# Altium project EzPowerV4 - REV09.PrjPcb (part 5 of 7)

## Sheet EVSE Control and GFCI.SchDoc: EVSE Control and GFCI
size A3; ApprovedBy: JTS; CheckedBy: JTS; DrawnBy: EBC; DocumentNumber: -; Revision: 09; SheetNumber: 5; SheetTotal: 7; SenaiProjectName: EzPower v4
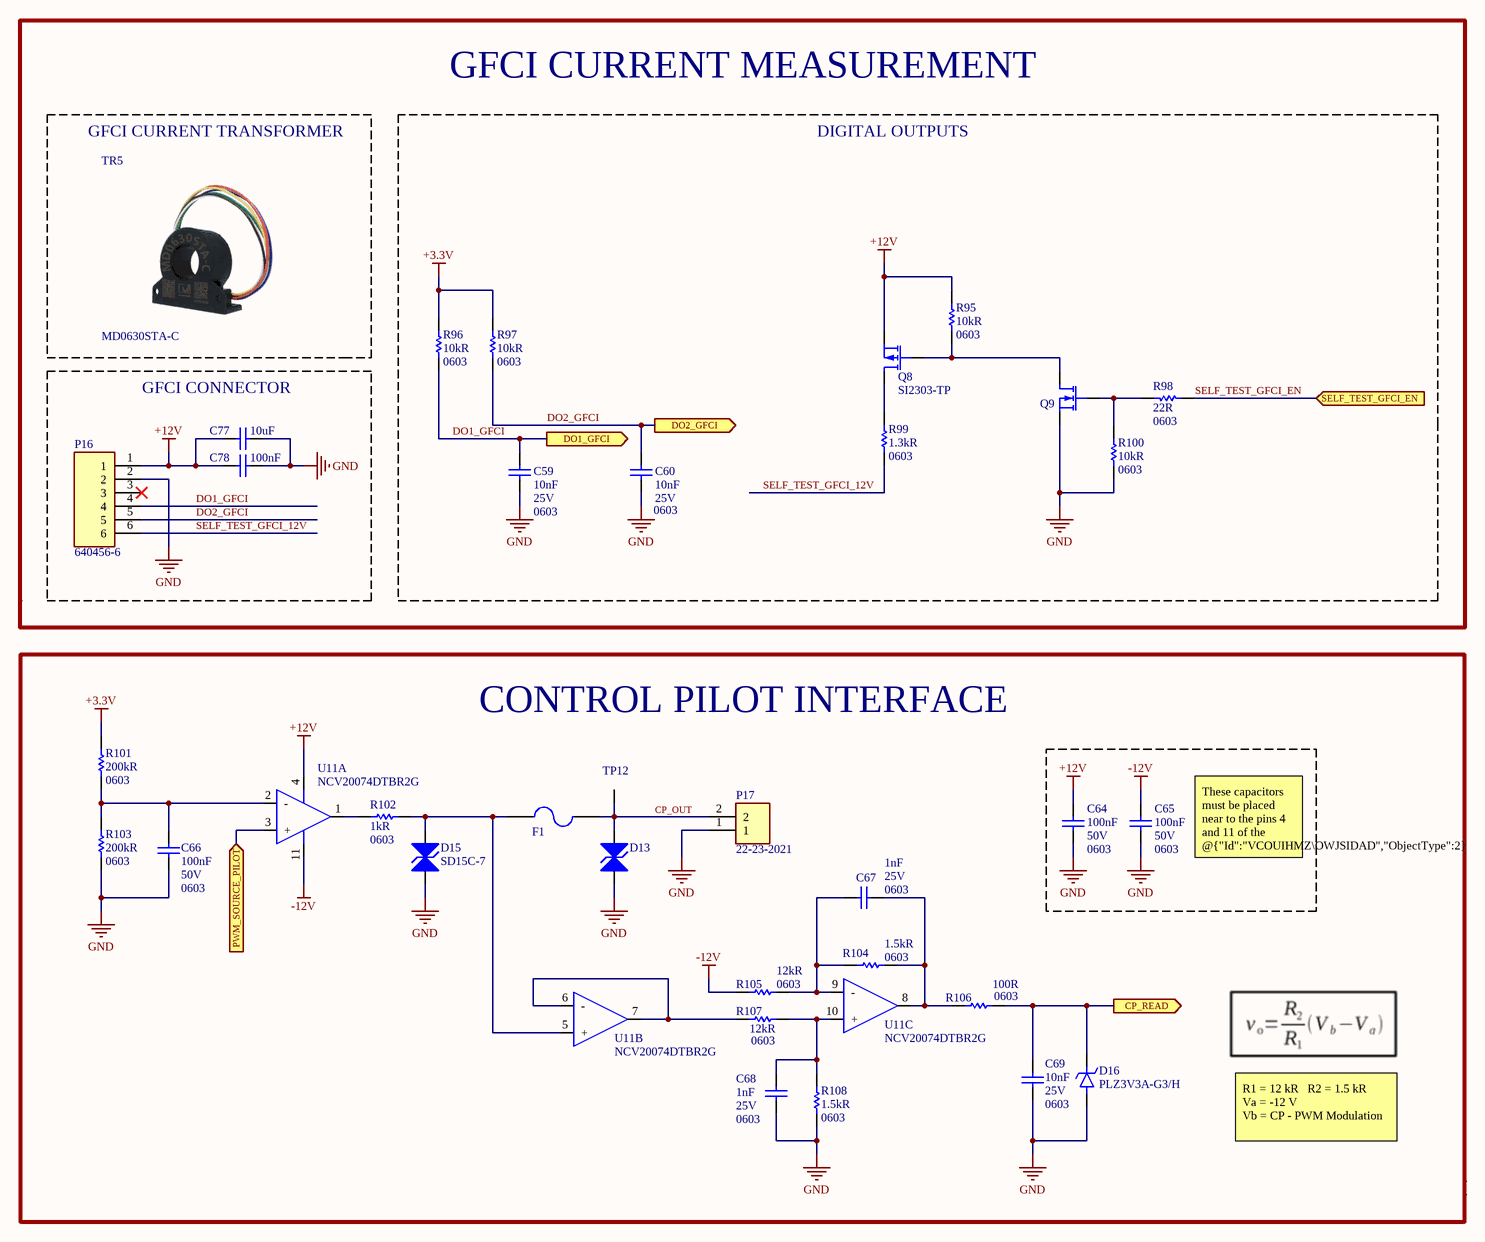
[diagram p7: EVSE Control and GFCI.SchDoc]

### Parts
C59  Voltage Rating: 25V  Capacitance: 10nF  Case Code (Imperial): 0603  [C0603]  (hidden comment: C_0603_0.01uF_25V_10%)
C60  Voltage Rating: 25V  Capacitance: 10nF  Case Code (Imperial): 0603  [C0603]  (hidden comment: C_0603_0.01uF_25V_10%)
C64  value 100nF  Case/Package: 0603  Voltage Rating: 50V  [C0603]  (hidden comment: CC0603MRX7R9BB104)
C65  value 100nF  Case/Package: 0603  Voltage Rating: 50V  [C0603]  (hidden comment: CC0603MRX7R9BB104)
C66  value 100nF  Case/Package: 0603  Voltage Rating: 50V  [C0603]  (hidden comment: CC0603MRX7R9BB104)
C67  value 1nF  Voltage Rating: 25V  Case Code (Imperial): 0603  [C0603]  (hidden comment: C0603C102J3GACTU)
C68  value 1nF  Voltage Rating: 25V  Case Code (Imperial): 0603  [C0603]  (hidden comment: C0603C102J3GACTU)
C69  Voltage Rating: 25V  Capacitance: 10nF  Case Code (Imperial): 0603  [C0603]  (hidden comment: C_0603_0.01uF_25V_10%)
C77  Capacitance: 10uF  [C0603]  (hidden comment: C_0603_10uF_35V_20%)
C78  value 100nF  [C0603]  (hidden comment: CC0603MRX7R9BB104)
D13  SM30T15CAY  [DO-214AB-2]  (value not drawn)
D15  SD15C-7  [SOD323]
D16  PLZ3V3A-G3/H  [DO-219AC-2]
F1  0ZCM0002FF2G  [F0603]  (value not drawn)
P16  640456-6  [HEADER_2.54MM_6POS_PTH]
P17  22-23-2021  [HEADER_KK_2.54MM_2POS]
Q8  SI2303-TP  [SOT23]
Q9  RSF015N06FRATL  [TUMT-3]  (value not drawn)
R95  value 10kR  Case/Package: 0603  [R0603]  (hidden comment: CRCW060310K0JNEBC)
R96  value 10kR  Case/Package: 0603  [R0603]  (hidden comment: CRCW060310K0JNEBC)
R97  value 10kR  Case/Package: 0603  [R0603]  (hidden comment: CRCW060310K0JNEBC)
R98  Resistance: 22R  Case Code (Imperial): 0603  [R0603]  (hidden comment: CRCW060322R0FKEAC)
R99  value 1.3kR  Case Code (Imperial): 0603  [R0603]  (hidden comment: ERJ-PA3F1301V)
R100  value 10kR  Case/Package: 0603  [R0603]  (hidden comment: CRCW060310K0JNEBC)
R101  value 200kR  Case/Package: 0603  [R0603]  (hidden comment: RT0603FRD07200KL)
R102  value 1kR  Case/Package: 0603  [R0603]  (hidden comment: CRT0603-FY-1001ELF)
R103  value 200kR  Case/Package: 0603  [R0603]  (hidden comment: RT0603FRD07200KL)
R104  value 1.5kR  Case Code (Imperial): 0603  [R0603]  (hidden comment: RN73H1JTTD1501F25)
R105  value 12kR  Case Code (Imperial): 0603  [R0603]  (hidden comment: RT0603DRD0712KL)
R106  value 100R  Case/Package: 0603  [R0603]  (hidden comment: CRT0603-FY-1000ELF)
R107  value 12kR  Case Code (Imperial): 0603  [R0603]  (hidden comment: RT0603DRD0712KL)
R108  value 1.5kR  Case Code (Imperial): 0603  [R0603]  (hidden comment: RN73H1JTTD1501F25)
TP12  S2761-46R  [TP_S276146R]  (value not drawn)
TR5  MD0630STA-C  [TC_MD0630STA-C]
U11  NCV20074DTBR2G  [TSSOP-14]  (parts A,B,C of 4)

### Blocks framed on the sheet
GFCI CURRENT TRANSFORMER: TR5
DIGITAL OUTPUTS: C59 C60 Q8 Q9 R95-R100
GFCI CONNECTOR: C77 C78 P16

### Ports
CP_READ (out), DO1_GFCI (out), DO2_GFCI (out), PWM_SOURCE_PILOT (in), SELF_TEST_GFCI_EN (in)

### Nets
+3.3V: R96.2 R97.2 R101.1
+12V: C64.1 C77.2 C78.2 P16.1 Q8.2(S) R95.2 U11.4(V+)
-12V: C65.1 R105.1 U11.11(V-)
GND: C59.1 C60.1 C64.2 C65.2 C66.2 C68.1 C69.2 C77.1 C78.1 D13.1 D15.1 D16.2(A) P16.2 P17.1 Q9.2(S) R100.1 R103.2 R108.2  [project net EARTH]
CP_OUT: D13.2 F1.2 P17.2 TP12.1
DO1_GFCI: C59.2 P16.4 R96.1 ; port DO1_GFCI
DO2_GFCI: C60.2 P16.5 R97.1 ; port DO2_GFCI
SELF_TEST_GFCI_12V: P16.6 R99.1
SELF_TEST_GFCI_EN: R98.2 ; port SELF_TEST_GFCI_EN
NetC66_1: C66.1 R101.2 R103.1 U11.2(-)
NetC67_1: C67.1 R104.2 R106.1 U11.8(OUT_C)
NetC67_2: C67.2 R104.1 R105.2 U11.9(-)
NetC68_2: C68.2 R107.2 R108.1 U11.10(+)
NetC69_1: C69.1 D16.1(K) R106.2 ; port CP_READ
NetD15_2: D15.2 F1.1 R102.1 U11.5(+)
NetQ8_1: Q8.1(G) Q9.3(D) R95.1
NetQ8_3: Q8.3(D) R99.2
NetQ9_1: Q9.1(G) R98.1 R100.2
NetR102_2: R102.2 U11.1(OUT_A)
NetR107_1: R107.1 U11.6(-) U11.7(OUT_B)
NetU1_30: U11.3(+) ; port PWM_SOURCE_PILOT

Not connected (* = marked no-connect by the designer): P16 3*

### Notes on the sheet
- GFCI CURRENT MEASUREMENT
- CONTROL PILOT INTERFACE
- These capacitors must be placed near to the pins 4 and 11 of the @{"Id":"VCOUIHMZ\OWJSIDAD","ObjectType":2}
- R1 = 12 kR   R2 = 1.5 kR
  Va = -12 V
  Vb = CP - PWM Modulation
- Title:
- Project:
- Variant:
- Size:
- Drawn by:
- A3
- Revision:
- Date:
- Sheet
- Time:
- of
- Checked by:
- Approved by:

### Library data of the parts
C59 C60 C69 = C_0603_0.01uF_25V_10%: Surface Mount Ceramic Multilayer Capacitor 0.01uF 10% X7R 25V 0603 Paper T/R; Manufacturer: Yageo; Manufacturer Part Number: CC0603KRX7R8BB103; Insulation Resistance: 100GR; Supplier 1: RSComponents; RoHS: Yes; Category: Ceramic Capacitors; Stock 1: 36000; Pricing 1: 4000=0,00900, 8000=0,00800, 16000=0,00700 (GBP); Mount: Surface Mount; Case/Package: 0603; Number of Pins: 2; Case Code (Metric): 1608; Dielectric Material: Ceramic; Min Operating Temperature: -55°C; Max Operating Temperature: 125°C; Tolerance: 10%; Dielectric: X7R; Voltage Rating (DC): 25V; Packaging: Tape and Reel; Package Quantity: 1; Termination: SMD/SMT; Resistor Type: Ceramic; Voltage: 25V; Series: CC; Length: 1.6mm; Width: 0.8mm; Height: 0.8mm; Thickness: 0.035inch; Depth: 0.8mm; Radiation Hardening: No; RoHS Compliant: Yes; REACH SVHC: Unknown; Lead Free: Lead Free; Halogen Free: Halogen Free; ComponentLink1URL: https://datasheet.ciiva.com/26862/getdatasheetpartid-134630-26862833.pdf?src-supplier=Verical; ComponentLink1Description: https://datasheet.ciiva.com/26862/getdatasheetpartid-134630-26862833.pdf?src-supplier=Verical; ComponentLink2URL: https://datasheet.ciiva.com/8033/70765-8033820.pdf?src-supplier=Element14; ComponentLink2Description: https://datasheet.ciiva.com/8033/70765-8033820.pdf?src-supplier=Element14; ComponentLink3URL: https://datasheet.ciiva.com/7978/1489800-7978152.pdf?src-supplier=Element14; ComponentLink3Description: https://datasheet.ciiva.com/7978/1489800-7978152.pdf?src-supplier=Element14; ComponentLink4URL: https://datasheet.ciiva.com/28450/1489800-28450573.pdf?src-supplier=Element14; ComponentLink4Description: https://datasheet.ciiva.com/28450/1489800-28450573.pdf?src-supplier=Element14; ComponentLink5URL: https://datasheet.ciiva.com/46430/1734573-46430157.pdf?src-supplier=Element14; ComponentLink5Description: https://datasheet.ciiva.com/46430/1734573-46430157.pdf?src-supplier=Element14; ComponentLink6URL: https://datasheet.ciiva.com/8033/1734573-8033822.pdf?src-supplier=Element14; ComponentLink6Description: https://datasheet.ciiva.com/8033/1734573-8033822.pdf?src-supplier=Element14; ComponentLink7URL: https://datasheet.ciiva.com/144/mlccorderingcode-144150.pdf?src-supplier=Digi-Key; ComponentLink7Description: https://datasheet.ciiva.com/144/mlccorderingcode-144150.pdf?src-supplier=Digi-Key; ComponentLink8URL: https://datasheet.ciiva.com/144/mlccorderingcode-144149.pdf?src-supplier=Digi-Key; ComponentLink8Description: https://datasheet.ciiva.com/144/mlccorderingcode-144149.pdf?src-supplier=Digi-Key; ComponentLink9URL: https://datasheet.ciiva.com/144/mlccorderingcode-144151.pdf?src-supplier=Digi-Key; ComponentLink9Description: https://datasheet.ciiva.com/144/mlccorderingcode-144151.pdf?src-supplier=Digi-Key; ComponentLink10URL: https://datasheet.ciiva.com/11465/upy-gphc-x7r-6-3v-to-50v-8-11465198.pdf?src-supplier=Avnet; ComponentLink10Description: https://datasheet.ciiva.com/11465/upy-gphc-x7r-6-3v-to-50v-8-11465198.pdf?src-supplier=Avnet; Supplier Part Number 1: 6698814
C64-C66 C78 = C_0603_0.1uF_50V_20%: Cap Ceramic 50V 20% +Tol 20% -Tol X7R 15% TC 0.1uF SMD 0603; Manufacturer: Yageo; Supplier 1: Arrow Electronics; Manufacturer Part Number: CC0603MRX7R9BB104; RoHS: Yes; Category: Ceramic Capacitors; Stock 1: 19775; Pricing 1: 4000=0,00850, 8000=0,00780, 12000=0,00740, 28000=0,00700, 100000=0,00520 (USD); Mounting Technology: Surface Mount; Case Code (Imperial): 0603; Case Code (Metric): 1608; Min Operating Temperature: -55°C; Max Operating Temperature: 125°C; Packaging: Tape and Reel; Tolerance: 20%; Dielectric: X7R; Voltage Rating (DC): 50V; Series: CC; Length: 0.063inch; Width: 0.031inch; Thickness: 0.035inch; Lead Free: Lead Free; Halogen Free: Halogen Free; RoHS Compliant: Yes; ComponentLink1URL: http://www.yageo.com/documents/recent/UPY-GPHC_X7R_6.3V-to-50V_18.pdf?src-supplier=Digi-Key; ComponentLink1Description: http://www.yageo.com/documents/recent/UPY-GPHC_X7R_6.3V-to-50V_18.pdf?src-supplier=Digi-Key; ComponentLink2URL: https://www.yageo.com/upload/media/product/productsearch/datasheet/mlcc/UPY-GPHC_X7R_6.3V-to-50V_18.pdf?src-supplier=Digi-Key; ComponentLink2Description: https://www.yageo.com/upload/media/product/productsearch/datasheet/mlcc/UPY-GPHC_X7R_6.3V-to-50V_18.pdf?src-supplier=Digi-Key; ComponentLink3URL: http://www.yageo.com/exep/pages/download/literatures/ProductSelectionGuide%202014_Final_2.pdf?src-supplier=Digi-Key; ComponentLink3Description: http://www.yageo.com/exep/pages/download/literatures/ProductSelectionGuide%202014_Final_2.pdf?src-supplier=Digi-Key; Supplier Part Number 1: CC0603MRX7R9BB104
C67 C68 = C_0603_1000pF_25V_5%: 0603 C 1nF Ceramic Multilayer Capacitor; 25 VDC; +125degC; C0G Dielectric; +/-5%; Manufacturer: KEMET; Tolerance: 5%; Temperature Coefficient: 30ppm/°C; Supplier 1: Mouser; Manufacturer Part Number: C0603C102J3GACTU; RoHS: Yes; Category: Ceramic Capacitors; Stock 1: 81365; Pricing 1: 1=0,1, 10=0,048, 50=0,048, 100=0,022, 1000=0,013, 10000=0,008 (USD); Mounting Technology: Surface Mount; Case/Package: 0603; Pins: 2; Case Code (Metric): 1608; Dielectric Material: Ceramic; Min Operating Temperature: -55°C; Max Operating Temperature: 125°C; Packaging: Tape and Reel; Package Quantity: 1; Voltage Rating (DC): 25V; Dielectric: C0G; Termination: SMD/SMT; Voltage: 25V; Series: C; Construction: Flat; Length: 1.6mm; Width: 0.031inch; Height: 0.8mm; Lead Pitch: 0.7mm; Thickness: 0.034inch; Depth: 0.8mm; Radiation Hardening: No; Reach SVHC Compliant: No; Lead Free: Lead Free; RoHS Compliant: Yes; ComponentLink1URL: https://datasheet.ciiva.com/18192/getdatasheetpartid-127803-18192629.pdf?src-supplier=Verical; ComponentLink1Description: https://datasheet.ciiva.com/18192/getdatasheetpartid-127803-18192629.pdf?src-supplier=Verical; ComponentLink2URL: https://datasheet.ciiva.com/7823/f9080b-0402-series-c0g-7823966.pdf?src-supplier=Element14; ComponentLink2Description: https://datasheet.ciiva.com/7823/f9080b-0402-series-c0g-7823966.pdf?src-supplier=Element14; ComponentLink3URL: https://datasheet.ciiva.com/7823/f9080b-0402-series-c0g-7823967.pdf?src-supplier=Element14; ComponentLink3Description: https://datasheet.ciiva.com/7823/f9080b-0402-series-c0g-7823967.pdf?src-supplier=Element14; Supplier Part Number 1: 80-C0603C102J3G
C77 = C_0603_10uF_35V_20%: Cap Ceramic 10uF 35V X5R 20% Pad SMD 0603 85C T/R; Manufacturer: Murata; Manufacturer Part Number: GRM188R6YA106MA73D; Supplier 1: Arrow Electronics; RoHS: Yes; Category: Ceramic Capacitors; Stock 1: 32291; Pricing 1: 1=0,31230, 10=0,18330, 25=0,18150, 100=0,12390, 250=0,12260, 500=0,08640, 1000=0,08550, 3000=0,07600, 6000=0,06650, 15000=0,06580, 30000=0,05360 (USD); Mount: Surface Mount; Case Code (Metric): 1608; Case Code (Imperial): 0603; Min Operating Temperature: -55°C; Max Operating Temperature: 85°C; Packaging: Tape and Reel; Voltage Rating (DC): 35V; Dielectric: X5R; Length: 0.063inch; Width: 0.031inch; Thickness: 0.039inch; RoHS Compliant: Yes; ComponentLink1URL: http://search.murata.co.jp/Ceramy/image/img/A01X/G101/ENG/GRM188R6YA106MA73-01.pdf?src-supplier=Future+Electronics; ComponentLink1Description: http://search.murata.co.jp/Ceramy/image/img/A01X/G101/ENG/GRM188R6YA106MA73-01.pdf?src-supplier=Future+Electronics; ComponentLink2URL: http://search.murata.co.jp/Ceramy/image/img/A01X/G101/ENG/GRM188R6YA106MA73-01.pdf?src-supplier=Digi-Key; ComponentLink2Description: http://search.murata.co.jp/Ceramy/image/img/A01X/G101/ENG/GRM188R6YA106MA73-01.pdf?src-supplier=Digi-Key; ComponentLink3URL: https://www.murata.com/~/media/webrenewal/support/library/catalog/products/capacitor/mlcc/c02e.ashx?la=en-us&src-supplier=Digi-Key; ComponentLink3Description: https://www.murata.com/~/media/webrenewal/support/library/catalog/products/capacitor/mlcc/c02e.ashx?la=en-us&src-supplier=Digi-Key; ComponentLink4URL: http://search.murata.co.jp/Ceramy/image/img/A01X/G101/ENG/GRM188R6YA106MA73-01.pdf?src-supplier=Mouser; ComponentLink4Description: http://search.murata.co.jp/Ceramy/image/img/A01X/G101/ENG/GRM188R6YA106MA73-01.pdf?src-supplier=Mouser; ComponentLink5URL: http://search.murata.co.jp/Ceramy/image/img/A01X/G101/ENG/GRM188R6YA106MA73-01.pdf?src-supplier=TTI; ComponentLink5Description: http://search.murata.co.jp/Ceramy/image/img/A01X/G101/ENG/GRM188R6YA106MA73-01.pdf?src-supplier=TTI; Tolerance: 20%; Supplier Part Number 1: GRM188R6YA106MA73D
D13 = D_TVS_SM30T15CAY: Trans Voltage Suppressor Diode, 3000W, 13V V(RWM), Bidirectional, 1 Element, Silicon, DO-214AB; Manufacturer: STMicroelectronics; Package Body Material: Plastic; Max Breakdown Voltage: 15.8V; Min Breakdown Voltage: 14.3V; Non-rep Peak Rev Power Dis-Max: 3kW; Number of Elements: 1; Reference Standard: AEC-Q101; Supplier: Arrow Electronics; Supplier Part Number: SM30T15CAY; Manufacturer Part Number: SM30T15CAY; RoHS: Yes; Category: TVS Diodes; Stock: 1424; Pricing: 1=0,5137 (USD); Pins: 2; Diode Element Material: SILICON; Package Shape: Rectangular; Min Operating Temperature: -55°C; Max Operating Temperature: 175°C; Polarity: Bidirectional; Diode Type: TRANS VOLTAGE SUPPRESSOR; JESD-30 Code: R-PDSO-C2; Package Style: SMALL OUTLINEMeter; Rep Pk Reverse Voltage-Max: 13V; Surface Mount: Yes; Technology: AVALANCHE; Terminal Form: C BEND; Terminal Position: DUAL; JEDEC-95 Code: DO-214AB; Reach SVHC Compliant: Yes; RoHS Compliant: Yes; ComponentLink1URL: https://datasheet.ciiva.com:443/pdfs/VipMasterIC/IC/SGST/SGST-S-A0009161970/SGST-S-A0009161970-1.pdf?src-supplier=IHS+Markit; ComponentLink1Description: https://datasheet.ciiva.com:443/pdfs/VipMasterIC/IC/SGST/SGST-S-A0009161970/SGST-S-A0009161970-1.pdf?src-supplier=IHS+Markit; ComponentLink2URL: http://www.farnell.com/datasheets/1966357.pdf?src-supplier=Farnell; ComponentLink2Description: http://www.farnell.com/datasheets/1966357.pdf?src-supplier=Farnell; ComponentLink3URL: http://www.mouser.com/ds/2/389/sm30ty-955243.pdf?src-supplier=Mouser; ComponentLink3Description: http://www.mouser.com/ds/2/389/sm30ty-955243.pdf?src-supplier=Mouser; ComponentLink4URL: https://datasheet.octopart.com/SM30T15CAY-STMicroelectronics-datasheet-38726152.pdf?src-supplier=Element14; ComponentLink4Description: https://datasheet.octopart.com/SM30T15CAY-STMicroelectronics-datasheet-38726152.pdf?src-supplier=Element14; ComponentLink5URL: http://www.st.com/content/ccc/resource/technical/document/datasheet/90/0c/ab/be/9d/d1/49/bd/DM00035136.pdf/files/DM00035136.pdf/jcr:content/translations/en.DM00035136.pdf?src-supplier=Digikey; ComponentLink5Description: http://www.st.com/content/ccc/resource/technical/document/datasheet/90/0c/ab/be/9d/d1/49/bd/DM00035136.pdf/files/DM00035136.pdf/jcr:content/translations/en.DM00035136.pdf?src-supplier=Digikey; ComponentLink6URL: http://www.st.com/st-web-ui/static/active/en/resource/technical/document/datasheet/DM00035136.pdf?src-supplier=Avnet; ComponentLink6Description: http://www.st.com/st-web-ui/static/active/en/resource/technical/document/datasheet/DM00035136.pdf?src-supplier=Avnet
D15 = D_TVS_SD15C-7: TVS Diode Bi-Directional 16.7V 12A 320W 2-Pin SOD-323 T/R; Manufacturer: Diodes; Supplier 1: Rs; RoHS: Yes; Category: TVS Diodes; Stock 1: 2950; Pricing 1: 50=0,00502, 100=0,13500, 250=0,13200, 500=0,11000, 1000=0,10700 (GBP); Supplier Part Number 1: 2060308; Manufacturer Part Number: SD15C-7
D16 = D_Zenner_PLZ3V3A-G3/H: Zener Diode Microsmf Do219Ac2.5%, 3.3V (3.16V - 3.38V), 0.5W; Manufacturer: Vishay; Supplier 1: Mouser; RoHS: Yes; Category: Zener Diodes; Stock 1: 22340; Pricing 1: 1=0,29000, 10=0,23900, 50=0,23900, 100=0,12700, 1000=0,05200, 10000=0,03400 (USD); RoHS Compliant: Yes; Supplier Part Number 1: 78-PLZ3V3A-G3/H; Manufacturer Part Number: PLZ3V3A-G3/H
F1 = F_0ZCM0002FF2G_0603: PTC Resettable Fuse, 60V, 12ohm, Surface Mount; Manufacturer: Bel; Supplier: Digikey; Supplier Part Number: 5923-0ZCM0002FF2GCT-ND; Manufacturer Part Number: 0ZCM0002FF2G; RoHS: Yes; Category: PTC Resettable Fuses; Stock: 66534; Pricing: 1=0,23, 5=0,192, 10=0,177, 50=0,1464, 100=0,1351, 250=0,12144, 500=0,11206, 1000=0,10336 (USD); ComponentLink1URL: http://www.farnell.com/datasheets/2830168.pdf?src-supplier=Farnell; ComponentLink1Description: http://www.farnell.com/datasheets/2830168.pdf?src-supplier=Farnell; ComponentLink2URL: https://datasheet.octopart.com/0ZCM0002FF2G-Bel-Fuse-datasheet-137317007.pdf?src-supplier=Farnell; ComponentLink2Description: https://datasheet.octopart.com/0ZCM0002FF2G-Bel-Fuse-datasheet-137317007.pdf?src-supplier=Farnell; ComponentLink3URL: https://belfuse.com/resources/datasheets/circuitprotection/ds-cp-0zcm-series.pdf?src-supplier=Digikey; ComponentLink3Description: https://belfuse.com/resources/datasheets/circuitprotection/ds-cp-0zcm-series.pdf?src-supplier=Digikey; ComponentLink4URL: https://datasheet.octopart.com/0ZCM0002FF2G-Bel-Fuse-datasheet-137317007.pdf?src-supplier=Element14; ComponentLink4Description: https://datasheet.octopart.com/0ZCM0002FF2G-Bel-Fuse-datasheet-137317007.pdf?src-supplier=Element14; ComponentLink5URL: http://www.farnell.com/datasheets/2830168.pdf?src-supplier=Newark; ComponentLink5Description: http://www.farnell.com/datasheets/2830168.pdf?src-supplier=Newark; ComponentLink6URL: https://datasheet.octopart.com/0ZCM0002FF2G-Bel-Fuse-datasheet-137317007.pdf?src-supplier=Newark; ComponentLink6Description: https://datasheet.octopart.com/0ZCM0002FF2G-Bel-Fuse-datasheet-137317007.pdf?src-supplier=Newark; ComponentLink7URL: https://datasheet.octopart.com/0ZCM0002FF2G-Bel-Fuse-datasheet-154728316.pdf?src-supplier=Master+Electronics; ComponentLink7Description: https://datasheet.octopart.com/0ZCM0002FF2G-Bel-Fuse-datasheet-154728316.pdf?src-supplier=Master+Electronics
P16 = P_HEADER_6POS_2.54MM_PTH: Connector Wire to Board Header 6 Position 2.54mm Solder Straight Thru-Hole; Manufacturer: TE Connectivity; Plating: 154ConductorMaterial; Number of Positions: 6; Connector System: 5937ConnectorSystem; Current Rating: 5A; Mating Retention: 5962ProductFeature; Number of Contacts: 6NUMBER; PCB Mount Alignment: 5964ProductFeature; Voltage Rating: 250V; Contact Style: 4753ConnectorType; PCB Mount Retention: 5952PCBMountRetention; Gender: 29Gender; Circuit Application: 5778ConnectorType; Plating Thickness: 3.81um; Supplier 1: Arrow Electronics; Manufacturer Part Number: 640456-6; RoHS: Yes; Category: Connectors; Stock 1: 253706; Pricing 1: 1=0,2315, 10=0,2463, 100=0,214, 500=0,2041, 1000=0,1882, 2500=0,1616, 5000=0,1679, 10000=0,1633, 25000=0,1616 (USD); Mounting Technology: Through Hole; Pins: 6NUMBER; Contact Material: Copper Alloy; Contact Plating: 154ConductorMaterial; Contact Shape: Square; Housing Color: 47Colour; Housing Material: 4301ConductorMaterial; Color: 47Colour; Contact Finish - Mating: TIN; Insulation Material: Thermoplastic; Insulation Color: Natural; Min Operating Temperature: -55°C; Max Operating Temperature: 105°C; Series: MTA-100; Connector Type: Header; Number of Rows: 1; Termination: Solder; Orientation: 5495OrientationType; Sealable: 5964ProductFeature; Packaging: Bulk; Voltage Rating (AC): 250V; Shrouded: 5964ProductFeature; Fastening Type: Friction; Contact Type: Male Pin; Voltage Rating (DC): 250V; Operating Supply Voltage: 250V; Length: 17.78mm; Width: 5.715mm; Height: 7.874mm; Lead Pitch: 2.54mm; Flammability Rating: UL94 V-0; RoHS Compliant: Yes; Lead Free: 5697LeadFree; Supplier Part Number 1: 640456-6
P17 = P_Molex_HEADER_2POS_2.54MM_PTH: KK 254 Solid Header, Vertical, with Friction Lock, 2 Circuits, Tin (Sn) Plating; Manufacturer: Molex; Contact Resistance: 10mR; Number of Contacts: 2; Number of Circuits: 2NUMBER; Gender: 29Gender; Voltage Rating: 250V; Current Rating: 4A; Insulation Resistance: 500GR; Pitch: 2.54mm; Glow Wire Compliant: 16Compliance; Approvals: UL,CSA; Supplier 1: Mouser; RoHS: Yes; Category: Headers and Wire Housings; Stock 1: 76100; Pricing 1: 1=0,21, 10=0,124, 50=0,124, 100=0,096, 1000=0,086, 10000=0,073 (USD); Mounting Technology: Through Hole; Contact Plating: Tin,Copper; Contact Material: Brass; Color: White; Housing Color: White; Housing Material: Nylon; Min Operating Temperature: 0°C; Max Operating Temperature: 75°C; Orientation: Straight; Termination: Solder; Number of Rows: 1; Packaging: Bulk; Package Quantity: 3000; Number of Positions: 2; Series: KK; Voltage Rating (DC): 250V; Max Current Rating: 4A; Fastening Type: Friction; Contact Type: Male Pin; Length: 5.08mm; Height: 10.67mm; Depth: 6.35mm; Contact Mating Length: 0.295inch; Radiation Hardening: No; RoHS Compliant: Yes; Flammability Rating: UL94 V-0; Reach SVHC Compliant: Unknown; Lead Free: 5697LeadFree; Halogen Free: 5696HalogenFree; Supplier Part Number 1: 538-22-23-2021; Manufacturer Part Number: 22-23-2021
Q8 = Q_PMOS_SI2303-TP: Sample Fpn Only - P-channel Mosfet, SOT-23 Package; Manufacturer: MCC; Drain to Source Voltage (Vdss): 30V; Continuous Drain Current (ID): 3A; Rds On Max: 180mR; Input Capacitance: 226pF; Max Power Dissipation: 250mW; Supplier 1: Arrow Electronics; RoHS: Yes; Category: Uncategorized; Stock 1: 108000; Pricing 1: 3000=0,0777, 6000=0,074, 12000=0,0732, 15000=0,0711, 24000=0,0704, 30000=0,0654 (USD); Mounting Technology: Surface Mount; Case/Package: SOT-23; Min Operating Temperature: -55°C; Max Operating Temperature: 150°C; Packaging: Tape and Reel; Series: -; RoHS Compliant: Yes; ComponentLink1URL: http://components.arrow.com/part/dataview/56206646S301877N2022?src-supplier=Arrow+Electronics; ComponentLink1Description: http://components.arrow.com/part/dataview/56206646S301877N2022?src-supplier=Arrow+Electronics; ComponentLink2URL: http://www.mccsemi.com/up_pdf/SI2303(SOT-23).pdf?src-supplier=Digi-Key; ComponentLink2Description: http://www.mccsemi.com/up_pdf/SI2303(SOT-23).pdf?src-supplier=Digi-Key; Supplier Part Number 1: SI2303-TP; Manufacturer Part Number: SI2303-TP
Q9 = Q_RSF015N06FRATL_TUMT-3: Transistor Mosfet N-ch 60V 1.5A 3-PIN Tumt T/r; Manufacturer: Rohm; Rds On Max: 290mR; Input Capacitance: 110pF; Max Power Dissipation: 800mW; Supplier 1: Newark; RoHS: Yes; Category: MOSFETs; Stock 1: 15; Pricing 1: 5=0,43000, 10=0,35700, 25=0,31900, 50=0,28100, 100=0,24300, 250=0,21300, 500=0,18300, 1000=0,13700 (USD); Mounting Technology: Surface Mount; Case/Package: SMD/SMT; Packaging: Tape and Reel; Drain to Source Voltage (Vdss): 60V; Continuous Drain Current (ID): 1.5A; ComponentLink1URL: http://rohmfs.rohm.com/en/products/databook/datasheet/discrete/transistor/mosfet/rsf015n06fra-e.pdf?src-supplier=Digi-Key; ComponentLink1Description: http://rohmfs.rohm.com/en/products/databook/datasheet/discrete/transistor/mosfet/rsf015n06fra-e.pdf?src-supplier=Digi-Key; Supplier Part Number 1: 24AC5315; Manufacturer Part Number: RSF015N06FRATL
R95-R97 R100 = R_0603_10kR_5%_1/10W: Fixed Resistor, Metal Glaze/thick Film, 0.1W, 10000ohm, 75V, 5% +/-Tol, 200ppm/Cel, Surface Mount, 0603; Manufacturer: Vishay; Power: 100mW; Temperature Coefficient: -200200ppm/°C; Package Height: 0.45mm; Package Length: 1.6mm; Package Width: 0.8mm; Supplier: Mouser; Supplier Part Number: 71-CRCW060310K0JNEBC; Manufacturer Part Number: CRCW060310K0JNEBC; RoHS: Yes; Category: Chip SMD Resistors; Stock: 170759; Pricing: 1=0,1, 10=0,014, 50=0,014, 100=0,008, 1000=0,007, 10000=0,003 (USD); Pins: 2; Terminal Finish: Nickel; Min Operating Temperature: -55°C; Max Operating Temperature: 155°C; Tolerance: 5%; JESD-609 Code: e3; Resistor Type: FIXED RESISTOR; Construction: Chip; Package Style: SMTMeter; Packaging: Tape and Reel; Technology: METAL GLAZE/THICK FILM; Working Voltage: 75V; Reach SVHC Compliant: Yes; RoHS Compliant: Yes; ComponentLink1URL: https://datasheet.ciiva.com:443/pdfs/VipMasterIC/IC/VISH/VISH-S-A0003599164/VISH-S-A0003599164-1.pdf?src-supplier=IHS+Markit; ComponentLink1Description: https://datasheet.ciiva.com:443/pdfs/VipMasterIC/IC/VISH/VISH-S-A0003599164/VISH-S-A0003599164-1.pdf?src-supplier=IHS+Markit; ComponentLink2URL: http://www.vishay.com/docs/28773/crcwce3.pdf?src-supplier=Digikey; ComponentLink2Description: http://www.vishay.com/docs/28773/crcwce3.pdf?src-supplier=Digikey
R98 = R_0603_22R_1%_1/10W: Thick Film Resistors - SMD 1/10Watt 22ohms 1% Commercial Use; Manufacturer: Vishay; Temperature Coefficient: 100ppm/°C; Supplier 1: Mouser; Manufacturer Part Number: CRCW060322R0FKEAC; Stock 1: 59616; Pricing 1: 1=0.1, 10=0.036, 100=0.014, 500=0.009, 1000=0.005, 5000=0.004 (USD); Case/Package: 0603; Case Code (Metric): 1608; Min Operating Temperature: -55°C; Max Operating Temperature: 155°C; Composition: Thick Film; Packaging: Cut Tape; Tolerance: 1%; Number of Terminations: 2; Supplier 2: Digi-Key; Supplier Part Number 1: 71-CRCW060322R0FKEAC; Supplier Part Number 2: 541-4025-6-ND
R99 = R_0603_1.3kR_1%_1/4W: SMD Chip Resistor, 1.3 kOhm, ± 1%, 250 mW, 0603 [1608 Metric], Thick Film, Anti-Surge; Manufacturer: Panasonic; Power Rating: 250mW; Voltage Rating: 150V; Temperature Coefficient: 100ppm/°C; Supplier 1: Mouser; RoHS: Yes; Category: Chip SMD Resistors; Stock 1: 28149; Pricing 1: 1=0,13, 10=0,068, 50=0,068, 100=0,028, 1000=0,02, 10000=0,014 (USD); Mounting Technology: Surface Mount; Case/Package: 0603; Case Code (Metric): 1608; Min Operating Temperature: -55°C; Max Operating Temperature: 155°C; Tolerance: 1%; Resistor Type: Thick Film; Packaging: Cut Tape; Number of Terminations: 2; Termination: Solder; Max Power Dissipation: 250mW; Voltage Rating (DC): 150V; Features: Automotive AEC-Q200; Series: ERJ; Resistance Tolerance: 1%; Technology: THICK FILM; Length: 0.063inch; Width: 0.031inch; Height: 0.018inch; Depth: 0.8mm; Reach SVHC Compliant: No; ComponentLink1URL: https://datasheet.ciiva.com/49048/1801181-49048133.pdf?src-supplier=Element14; ComponentLink1Description: https://datasheet.ciiva.com/49048/1801181-49048133.pdf?src-supplier=Element14; Manufacturer Part Number: ERJ-PA3F1301V; Supplier Part Number 1: 667-ERJ-PA3F1301V
R101 R103 = R_0603_200kR_1%_1/10W_25PPM: Res Thin Film 0603 200K Ohm 1% 1/10W ±25ppm/°C Molded SMD Paper T/R; Manufacturer: Yageo; Max Power Dissipation: 100mW; Supplier 1: Mouser; Manufacturer Part Number: RT0603FRD07200KL; RoHS: Yes; Category: Chip SMD Resistors; Stock 1: 13355; Pricing 1: 1=0,15000, 10=0,12000, 50=0,12000, 100=0,03000, 1000=0,02000, 10000=0,01600 (USD); Min Operating Temperature: -55°C; Max Operating Temperature: 155°C; Packaging: Tape and Reel; Resistor Type: Thin Film; Number of Terminations: 2; Tolerance: 1%; Features: Moisture Resistant; Length: 0.063inch; Width: 0.031inch; Height: 0.022inch; RoHS Compliant: Yes; ComponentLink1URL: http://www.yageo.com/documents/recent/PYu-RT_1-to-0.01_RoHS_L_8.pdf?src-supplier=Digi-Key; ComponentLink1Description: http://www.yageo.com/documents/recent/PYu-RT_1-to-0.01_RoHS_L_8.pdf?src-supplier=Digi-Key; Supplier Part Number 1: 603-RT0603FRD07200KL; Temperature Coefficient: 25ppm/°C
R102 = R_0603_1kR_1%_1/10W_25PPM: RES SMD 1K OHM 1% 1/10W 0603; Manufacturer: Bourns; Max Power Dissipation: 63mW; Temperature Coefficient: 25ppm/°C; Supplier 1: Mouser; Manufacturer Part Number: CRT0603-FY-1001ELF; RoHS: Yes; Category: Chip SMD Resistors; Stock 1: 13513; Pricing 1: 1=0,13000, 10=0,12000, 50=0,12000, 100=0,04600, 1000=0,02100, 10000=0,01800 (USD); Package Quantity: 5000; Packaging: Tape and Reel; Tolerance: 1%; Resistor Type: Thin Film; Number of Terminations: 2; Length: 0.061inch; Width: 0.031inch; Height: 0.024inch; ComponentLink1URL: http://www.bourns.com/docs/Product-Datasheets/crt.pdf?src-supplier=Digi-Key; ComponentLink1Description: http://www.bourns.com/docs/Product-Datasheets/crt.pdf?src-supplier=Digi-Key; Supplier Part Number 1: 652-CRT0603FY1001ELF
R104 R108 = R_0603_1.5kR_1%_1/10W_25PPM: Res 1.5K Ohm 1% 1/10W 0603; Manufacturer: KOA Speer; Voltage Rating: 75V; Power Rating: 100mW; Temperature Coefficient: 25ppm/°C; Supplier 1: Mouser; Manufacturer Part Number: RN73H1JTTD1501F25; RoHS: Yes; Category: Chip SMD Resistors; Stock 1: 4956; Pricing 1: 1=0,37000, 10=0,28300, 50=0,28300, 100=0,11900, 1000=0,06600, 10000=0,05400 (USD); Case/Package: 0603; Case Code (Metric): 1608; Min Operating Temperature: -55°C; Max Operating Temperature: 155°C; Packaging: Tape and Reel; Tolerance: 1%; Termination: SMD/SMT; Voltage Rating (DC): 75V; Series: RN73H; RoHS Compliant: Yes; ComponentLink1URL: https://datasheet.ciiva.com/12739/rn73h-12739415.pdf?src-supplier=Mouser; ComponentLink1Description: https://datasheet.ciiva.com/12739/rn73h-12739415.pdf?src-supplier=Mouser; Supplier Part Number 1: 660-RN73H1JTD1501F25
R105 R107 = R_0603_12kR_0.5%_1/10W_25PPM: Res Thin Film 0603 12K Ohm 0.5% 1/10W ±25ppm/°C Molded SMD SMD Paper T/R; Manufacturer: Yageo; Max Power Dissipation: 100mW; Voltage Rating (DC): 50V; Supplier 1: Rs; Manufacturer Part Number: RT0603DRD0712KL; RoHS: Yes; Category: Chip SMD Resistors; Stock 1: 6410; Pricing 1: 100=0,01200, 250=0,11200, 500=0,10500, 1000=0,09600 (GBP); Case/Package: 0603; Case Code (Metric): 1608; Contact Plating: Tin,Matte; Min Operating Temperature: -55°C; Max Operating Temperature: 125°C; Packaging: Tape and Reel; Package Quantity: 1; Resistor Type: Thin Film; Number of Terminations: 2; Temperature Coefficient: 25ppm/°C; Features: Moisture Resistant; Series: RT; Construction: Rectangular; Length: 0.063inch; Width: 0.031inch; Height: 0.022inch; Depth: 0.8mm; Radiation Hardening: No; Military Standard: Not; Lead Free: Lead Free; RoHS Compliant: Yes; ComponentLink1URL: http://www.yageo.com/documents/recent/PYu-RT_1-to-0.01_RoHS_L_8.pdf?src-supplier=Digi-Key; ComponentLink1Description: http://www.yageo.com/documents/recent/PYu-RT_1-to-0.01_RoHS_L_8.pdf?src-supplier=Digi-Key; ComponentLink2URL: http://www.yageo.com/documents/recent/PYu-RT_1-to-0.01_RoHS_L_9.pdf?src-supplier=Digi-Key; ComponentLink2Description: http://www.yageo.com/documents/recent/PYu-RT_1-to-0.01_RoHS_L_9.pdf?src-supplier=Digi-Key; ComponentLink3URL: http://www.yageo.com/documents/recent/PYu-RT_1-to-0.05_RoHS_L_6.pdf?src-supplier=Avnet; ComponentLink3Description: http://www.yageo.com/documents/recent/PYu-RT_1-to-0.05_RoHS_L_6.pdf?src-supplier=Avnet; Supplier Part Number 1: 1991661P
R106 = R_0603_100R_1%_1/10W_25PPM: Res Thin Film 0603 100 Ohm 1% 1/10W ±25ppm/°C Molded SMD Paper Tape on Plastic Reel; Manufacturer: Bourns; Max Power Dissipation: 63mW; Supplier 1: Mouser; Manufacturer Part Number: CRT0603-FY-1000ELF; RoHS: Yes; Category: Chip SMD Resistors; Stock 1: 20511; Pricing 1: 1=0,17000, 10=0,15600, 50=0,15600, 100=0,06000, 1000=0,02700, 10000=0,01800 (USD); Package Quantity: 5000; Packaging: Tape and Reel; Tolerance: 1%; Resistor Type: Thin Film; Number of Terminations: 2; Temperature Coefficient: 25ppm/°C; Length: 0.061inch; Width: 0.031inch; Height: 0.024inch; ComponentLink1URL: http://www.bourns.com/docs/Product-Datasheets/crt.pdf?src-supplier=Digi-Key; ComponentLink1Description: http://www.bourns.com/docs/Product-Datasheets/crt.pdf?src-supplier=Digi-Key; Supplier Part Number 1: 652-CRT0603FY1000ELF
TP12 = TP_S2761-46R_SMT: Natural PC Test Point 0.063 x 0.031 x 0.045 (1.60mm x 0.80mm x 1.15mm) Brass, Tin Plating Surface Mount Mounting Type; Manufacturer: Harwin; Supplier: Digi-Key; Supplier Part Number: 952-2665-1-ND; Manufacturer Part Number: S2761-46R; RoHS: Yes; Category: Headers and Wire Housings; Stock: 224369; Pricing: 1=0,31000, 10=0,26400, 25=0,23280, 50=0,21380, 100=0,20540, 250=0,18444, 500=0,17604, 1000=0,14670 (USD); Mounting Technology: Surface Mount; Color: Natural; Plating: Tin; Body Material: Brass; Weight: 0.000212oz; Packaging: Cut Tape; Package Quantity: 3000; Series: S2761, EZ BoardWare; Length: 1.6mm; RoHS Compliant: Yes; ComponentLink1URL: https://cdn.harwin.com/pdfs/S2761R.pdf?src-supplier=Newark; ComponentLink1Description: https://cdn.harwin.com/pdfs/S2761R.pdf?src-supplier=Newark; ComponentLink2URL: https://cdn.harwin.com/pdfs/Harwin_PC_PCB_Hardware.pdf?src-supplier=Mouser; ComponentLink2Description: https://cdn.harwin.com/pdfs/Harwin_PC_PCB_Hardware.pdf?src-supplier=Mouser; ComponentLink3URL: https://cdn.harwin.com/pdfs/Harwin_PC_PCB_Hardware.pdf?src-supplier=Digi-Key; ComponentLink3Description: https://cdn.harwin.com/pdfs/Harwin_PC_PCB_Hardware.pdf?src-supplier=Digi-Key; ComponentLink4URL: https://cdn.harwin.com/pdfs/Harwin_PC_PCB_Hardware.pdf?src-supplier=TTI; ComponentLink4Description: https://cdn.harwin.com/pdfs/Harwin_PC_PCB_Hardware.pdf?src-supplier=TTI
TR5 = TR_MD0630STA-C: MD36da-P Costly Evse B-Type RCD CT 6mA DC Residual Direct Current Detecting Device Sensor; Manufacter Part Number: MD0630STA-C
U11 = U_NCV20074DTBR2G_TSSOP-14: Operational Amplifier, Wide supply range, 3 MHz CMOS Op-Amp; Manufacturer: ON Semiconductor; Number of Circuits: 4; Slew Rate: 2.4V/µs; Gain Bandwidth Product: 3.2MHz; Input Bias Current: 1.5nA; Input Offset Voltage (Vos): 1.3mV; Operating Supply Current: 465uA; Output Current per Channel: 65mA; Supplier 1: Arrow Electronics; Manufacturer Part Number: NCV20074DTBR2G; RoHS: Yes; Category: Amplifiers - Op Amps, Buffer, Instrumentation; Stock 1: 2188; Pricing 1: 1=1,23550, 10=1,10740, 25=1,04090, 100=0,85010, 250=0,78770, 500=0,69050, 1000=0,52710 (USD); Mounting Technology: Surface Mount; Case/Package: TSSOP; Min Operating Temperature: -40°C; Max Operating Temperature: 125°C; Lead Free: Lead Free; RoHS Compliant: Yes; ComponentLink1URL: http://www.mouser.com/ds/2/308/NCS20071-D-470030.pdf?src-supplier=Mouser; ComponentLink1Description: http://www.mouser.com/ds/2/308/NCS20071-D-470030.pdf?src-supplier=Mouser; ComponentLink2URL: http://www.onsemi.com/pub/Collateral/NCS20071-D.PDF?src-supplier=Digi-Key; ComponentLink2Description: http://www.onsemi.com/pub/Collateral/NCS20071-D.PDF?src-supplier=Digi-Key; ComponentLink3URL: http://www.onsemi.com/pub/Collateral/NCS20071-D.PDF?src-supplier=Avnet; ComponentLink3Description: http://www.onsemi.com/pub/Collateral/NCS20071-D.PDF?src-supplier=Avnet; Supplier Part Number 1: NCV20074DTBR2G